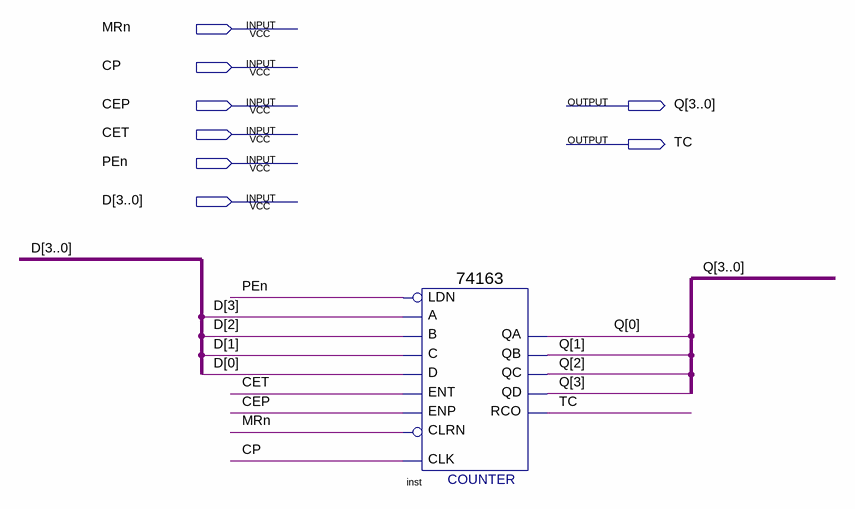
[diagram p0: schematic sheet]
// Quartus schematic ttl74163.bdf as structural Verilog: 1 symbols, 8 pins
module ttl74163 (
  input  MRn,
  input  CP,
  input  CEP,
  input  CET,
  input  PEn,
  input  [3:0] D,
  output [3:0] Q,
  output TC
);

  \74163  inst (
    .C(D[1]), .B(D[2]), .A(D[3]), .ENT(CET), .D(D[0]), .CLRN(MRn), .CLK(CP), .ENP(CEP), .LDN(PEn), .QA(Q[0]),
    .QB(Q[1]), .QC(Q[2]), .QD(Q[3]), .RCO(TC));
endmodule
